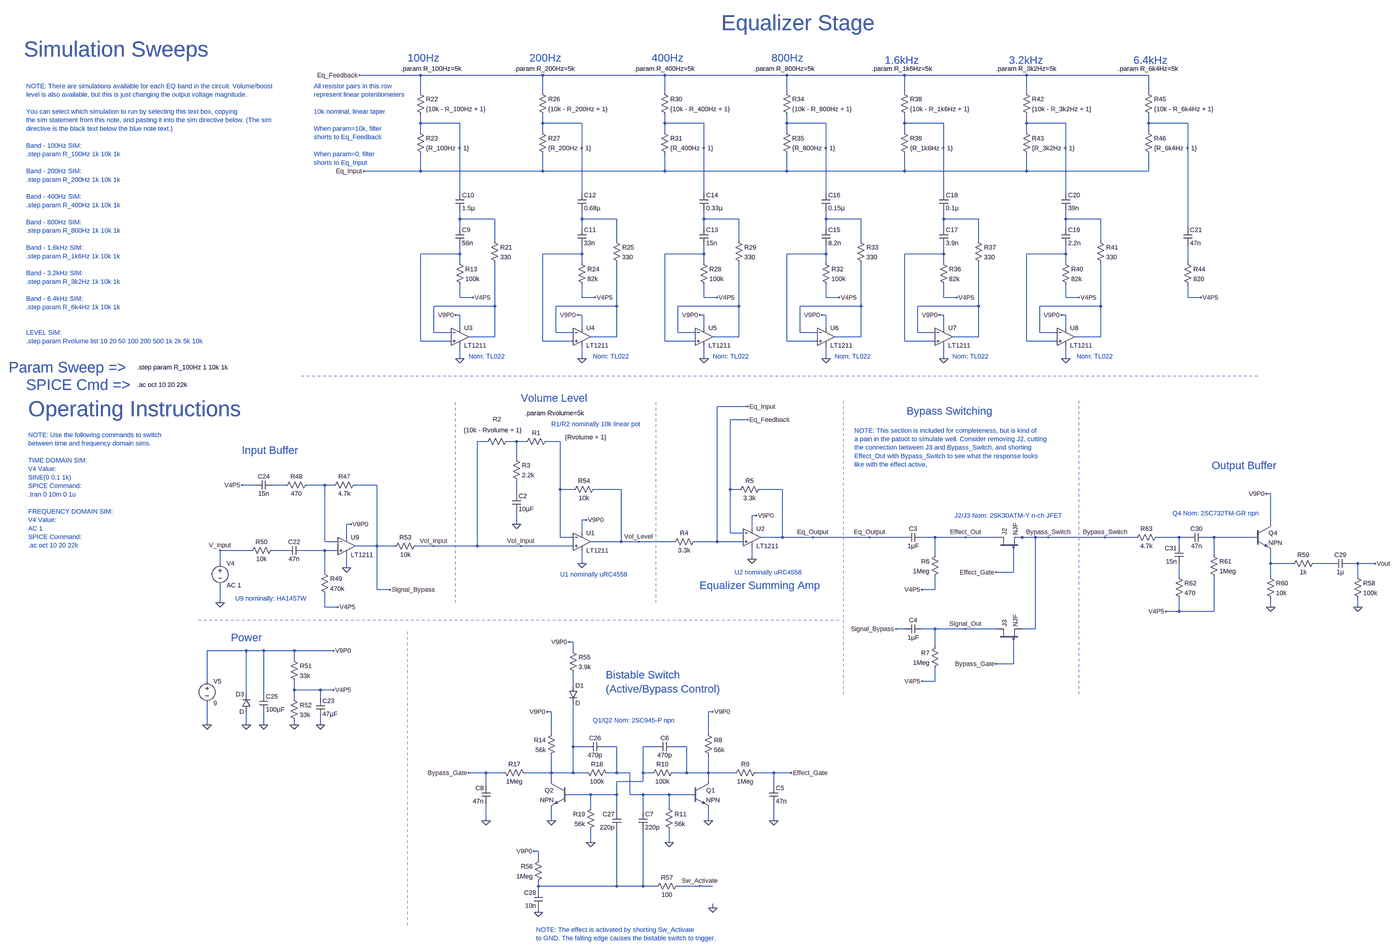
[diagram p0: schematic boss-ge7-equalizer.asc, whole sheet]
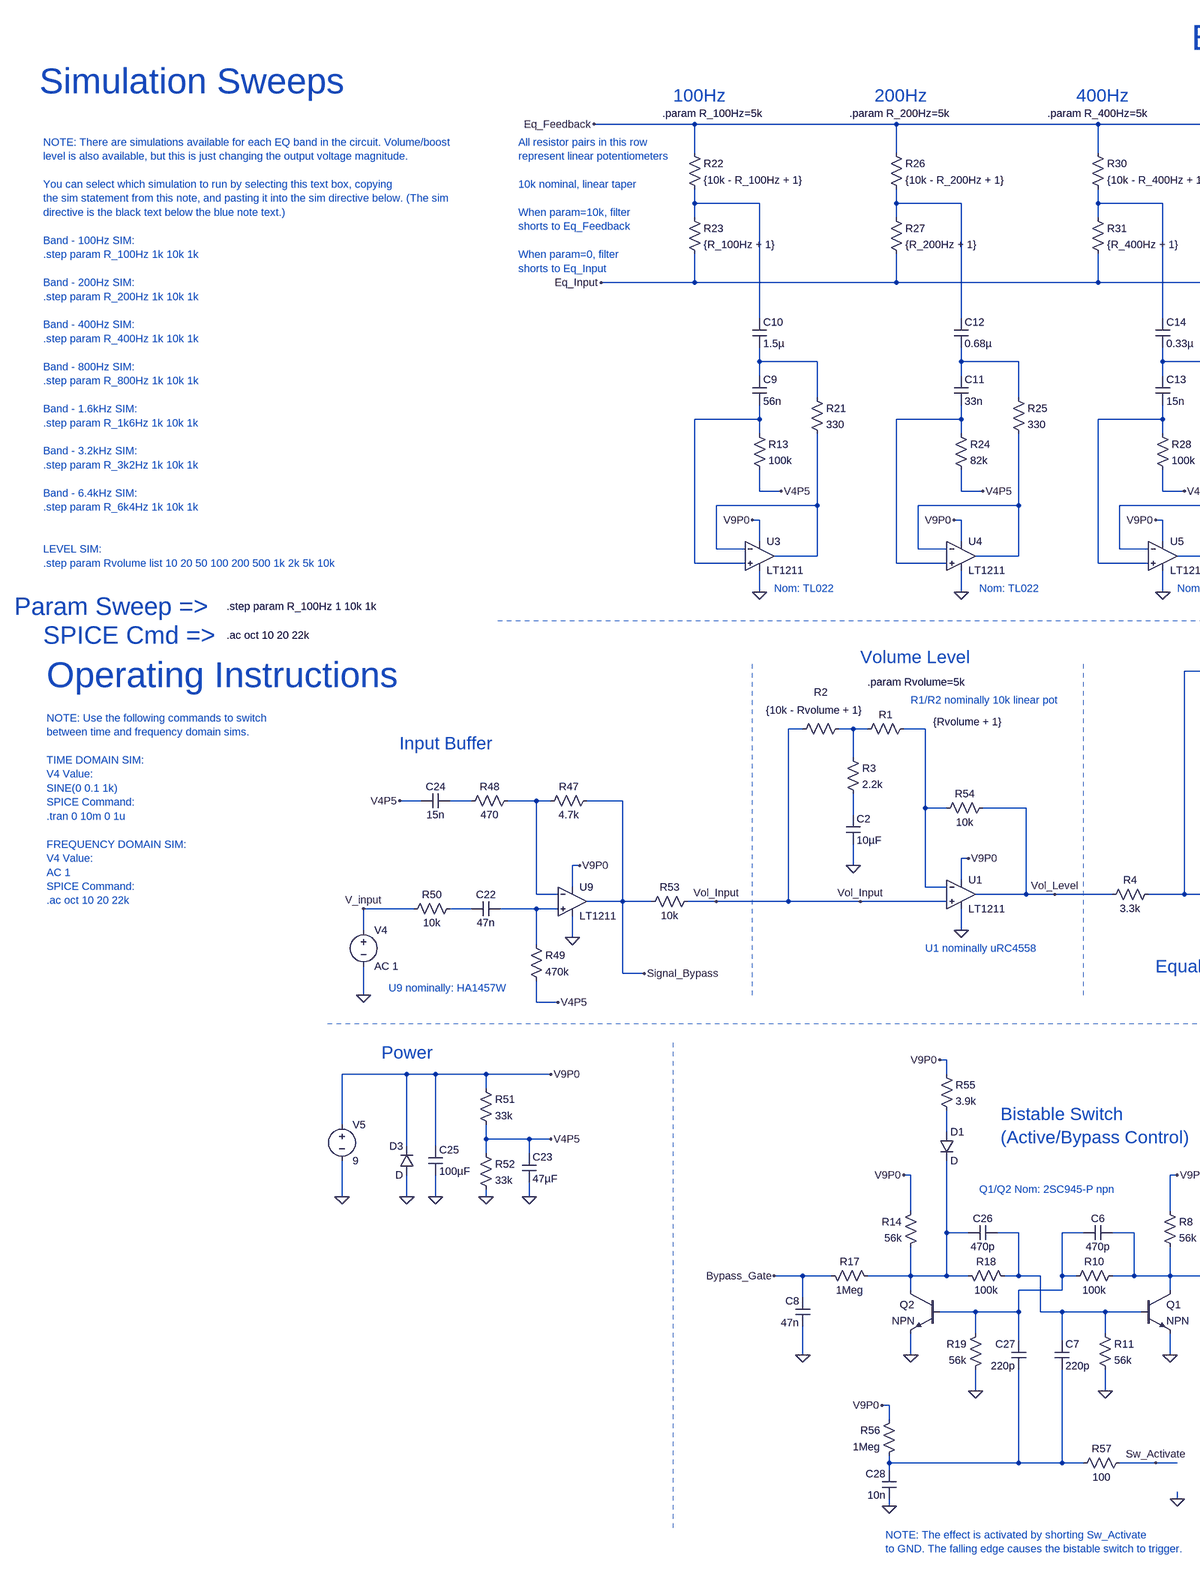
[diagram p1: schematic boss-ge7-equalizer.asc, part, row 1 of 1, column 1 of 2]
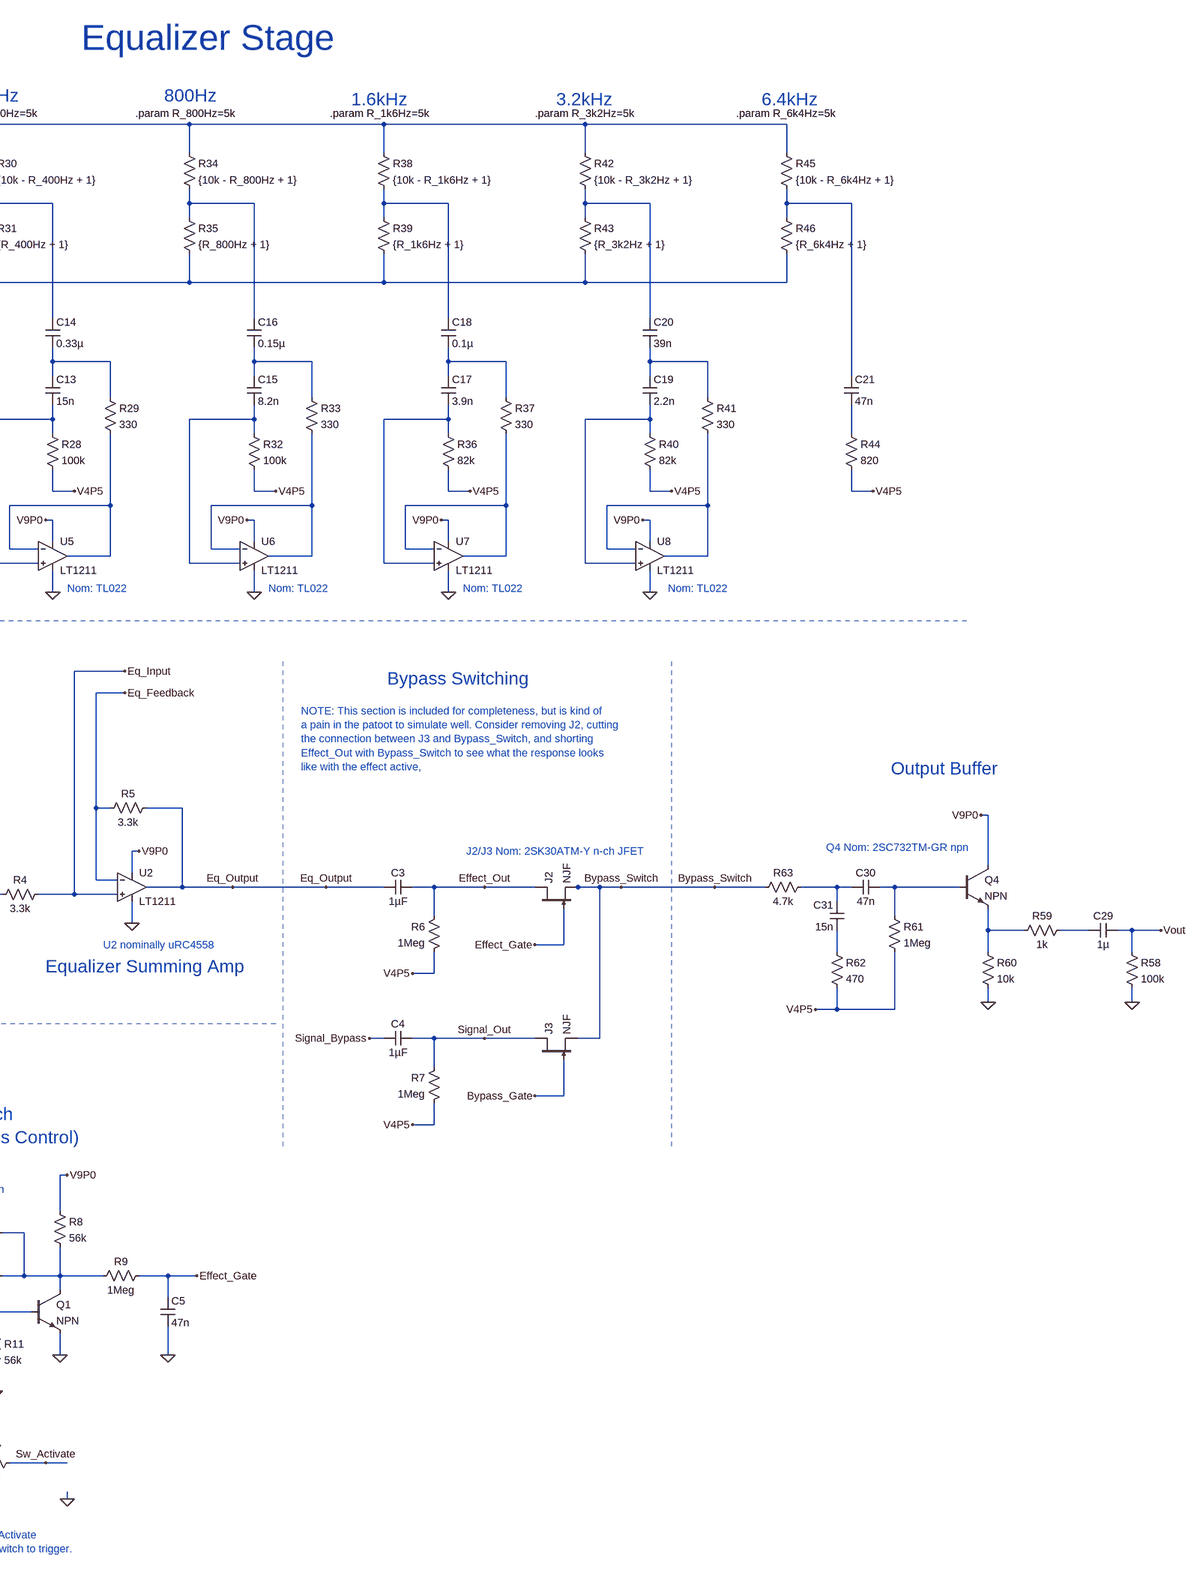
[diagram p2: schematic boss-ge7-equalizer.asc, part, row 1 of 1, column 2 of 2]
boss-ge7-equalizer.asc, the LTspice schematic file:
Version 4
SHEET 1 3852 5064
WIRE 160 1184 -64 1184
WIRE 608 1184 160 1184
WIRE 1056 1184 608 1184
WIRE 1504 1184 1056 1184
WIRE 1936 1184 1504 1184
WIRE 2384 1184 1936 1184
WIRE 2832 1184 2384 1184
WIRE 160 1248 160 1184
WIRE 608 1248 608 1184
WIRE 1056 1248 1056 1184
WIRE 1504 1248 1504 1184
WIRE 1936 1248 1936 1184
WIRE 2384 1248 2384 1184
WIRE 2832 1248 2832 1184
WIRE 160 1360 160 1328
WIRE 304 1360 160 1360
WIRE 608 1360 608 1328
WIRE 752 1360 608 1360
WIRE 1056 1360 1056 1328
WIRE 1200 1360 1056 1360
WIRE 1504 1360 1504 1328
WIRE 1648 1360 1504 1360
WIRE 1936 1360 1936 1328
WIRE 2080 1360 1936 1360
WIRE 2384 1360 2384 1328
WIRE 2528 1360 2384 1360
WIRE 2832 1360 2832 1328
WIRE 2976 1360 2832 1360
WIRE 160 1392 160 1360
WIRE 608 1392 608 1360
WIRE 1056 1392 1056 1360
WIRE 1504 1392 1504 1360
WIRE 1936 1392 1936 1360
WIRE 2384 1392 2384 1360
WIRE 2832 1392 2832 1360
WIRE 160 1536 160 1472
WIRE 160 1536 -48 1536
WIRE 608 1536 608 1472
WIRE 608 1536 160 1536
WIRE 1056 1536 1056 1472
WIRE 1056 1536 608 1536
WIRE 1504 1536 1504 1472
WIRE 1504 1536 1056 1536
WIRE 1936 1536 1936 1472
WIRE 1936 1536 1504 1536
WIRE 2384 1536 2384 1472
WIRE 2384 1536 1936 1536
WIRE 2832 1536 2832 1472
WIRE 2832 1536 2384 1536
WIRE 304 1616 304 1360
WIRE 752 1616 752 1360
WIRE 1200 1616 1200 1360
WIRE 1648 1616 1648 1360
WIRE 2080 1616 2080 1360
WIRE 2528 1616 2528 1360
WIRE 304 1712 304 1680
WIRE 432 1712 304 1712
WIRE 752 1712 752 1680
WIRE 880 1712 752 1712
WIRE 1200 1712 1200 1680
WIRE 1328 1712 1200 1712
WIRE 1648 1712 1648 1680
WIRE 1776 1712 1648 1712
WIRE 2080 1712 2080 1680
WIRE 2208 1712 2080 1712
WIRE 2528 1712 2528 1680
WIRE 2656 1712 2528 1712
WIRE 304 1744 304 1712
WIRE 752 1744 752 1712
WIRE 1200 1744 1200 1712
WIRE 1648 1744 1648 1712
WIRE 2080 1744 2080 1712
WIRE 2528 1744 2528 1712
WIRE 2976 1744 2976 1360
WIRE 432 1792 432 1712
WIRE 880 1792 880 1712
WIRE 1328 1792 1328 1712
WIRE 1776 1792 1776 1712
WIRE 2208 1792 2208 1712
WIRE 2656 1792 2656 1712
WIRE 304 1840 304 1808
WIRE 304 1840 160 1840
WIRE 752 1840 752 1808
WIRE 752 1840 608 1840
WIRE 1200 1840 1200 1808
WIRE 1200 1840 1056 1840
WIRE 1648 1840 1648 1808
WIRE 1648 1840 1504 1840
WIRE 2080 1840 2080 1808
WIRE 2080 1840 1936 1840
WIRE 2528 1840 2528 1808
WIRE 2528 1840 2384 1840
WIRE 304 1872 304 1840
WIRE 752 1872 752 1840
WIRE 1200 1872 1200 1840
WIRE 1648 1872 1648 1840
WIRE 2080 1872 2080 1840
WIRE 2528 1872 2528 1840
WIRE 2976 1872 2976 1808
WIRE 304 2000 304 1952
WIRE 352 2000 304 2000
WIRE 752 2000 752 1952
WIRE 800 2000 752 2000
WIRE 1200 2000 1200 1952
WIRE 1248 2000 1200 2000
WIRE 1648 2000 1648 1952
WIRE 1696 2000 1648 2000
WIRE 2080 2000 2080 1952
WIRE 2128 2000 2080 2000
WIRE 2528 2000 2528 1952
WIRE 2576 2000 2528 2000
WIRE 2976 2000 2976 1952
WIRE 3024 2000 2976 2000
WIRE 432 2032 432 1872
WIRE 432 2032 208 2032
WIRE 880 2032 880 1872
WIRE 880 2032 656 2032
WIRE 1328 2032 1328 1872
WIRE 1328 2032 1104 2032
WIRE 1776 2032 1776 1872
WIRE 1776 2032 1552 2032
WIRE 2208 2032 2208 1872
WIRE 2208 2032 1984 2032
WIRE 2656 2032 2656 1872
WIRE 2656 2032 2432 2032
WIRE 304 2064 288 2064
WIRE 752 2064 736 2064
WIRE 1200 2064 1184 2064
WIRE 1648 2064 1632 2064
WIRE 2080 2064 2064 2064
WIRE 2528 2064 2512 2064
WIRE 304 2112 304 2064
WIRE 752 2112 752 2064
WIRE 1200 2112 1200 2064
WIRE 1648 2112 1648 2064
WIRE 2080 2112 2080 2064
WIRE 2528 2112 2528 2064
WIRE 208 2128 208 2032
WIRE 272 2128 208 2128
WIRE 656 2128 656 2032
WIRE 720 2128 656 2128
WIRE 1104 2128 1104 2032
WIRE 1168 2128 1104 2128
WIRE 1552 2128 1552 2032
WIRE 1616 2128 1552 2128
WIRE 1984 2128 1984 2032
WIRE 2048 2128 1984 2128
WIRE 2432 2128 2432 2032
WIRE 2496 2128 2432 2128
WIRE 432 2144 432 2032
WIRE 432 2144 336 2144
WIRE 880 2144 880 2032
WIRE 880 2144 784 2144
WIRE 1328 2144 1328 2032
WIRE 1328 2144 1232 2144
WIRE 1776 2144 1776 2032
WIRE 1776 2144 1680 2144
WIRE 2208 2144 2208 2032
WIRE 2208 2144 2112 2144
WIRE 2656 2144 2656 2032
WIRE 2656 2144 2560 2144
WIRE 160 2160 160 1840
WIRE 272 2160 160 2160
WIRE 608 2160 608 1840
WIRE 720 2160 608 2160
WIRE 1056 2160 1056 1840
WIRE 1168 2160 1056 2160
WIRE 1504 2160 1504 1840
WIRE 1616 2160 1504 2160
WIRE 1936 2160 1936 1840
WIRE 2048 2160 1936 2160
WIRE 2384 2160 2384 1840
WIRE 2496 2160 2384 2160
WIRE 304 2224 304 2176
WIRE 752 2224 752 2176
WIRE 1200 2224 1200 2176
WIRE 1648 2224 1648 2176
WIRE 2080 2224 2080 2176
WIRE 2528 2224 2528 2176
WIRE 1360 2400 1248 2400
WIRE 1360 2448 1296 2448
WIRE 400 2528 368 2528
WIRE 512 2528 480 2528
WIRE 544 2528 512 2528
WIRE 672 2528 624 2528
WIRE 512 2592 512 2528
WIRE -448 2688 -496 2688
WIRE -336 2688 -384 2688
WIRE -192 2688 -256 2688
WIRE -160 2688 -192 2688
WIRE 0 2688 -80 2688
WIRE 672 2704 672 2528
WIRE 720 2704 672 2704
WIRE 896 2704 800 2704
WIRE 1296 2704 1296 2448
WIRE 1328 2704 1296 2704
WIRE 1488 2704 1408 2704
WIRE 512 2720 512 2672
WIRE 3280 2720 3264 2720
WIRE 1392 2800 1376 2800
WIRE 768 2816 752 2816
WIRE -96 2832 -112 2832
WIRE 512 2832 512 2784
WIRE 3280 2832 3280 2720
WIRE 1376 2848 1376 2800
WIRE 752 2864 752 2816
WIRE 1296 2864 1296 2704
WIRE 1344 2864 1296 2864
WIRE -112 2880 -112 2832
WIRE 672 2880 672 2704
WIRE 720 2880 672 2880
WIRE 1488 2880 1488 2704
WIRE 1488 2880 1408 2880
WIRE 1600 2880 1488 2880
WIRE 1808 2880 1600 2880
WIRE 1936 2880 1808 2880
WIRE 2048 2880 2000 2880
WIRE 2160 2880 2048 2880
WIRE 2272 2880 2160 2880
WIRE 2368 2880 2352 2880
WIRE 2416 2880 2368 2880
WIRE 2464 2880 2416 2880
WIRE 2672 2880 2464 2880
WIRE 2784 2880 2672 2880
WIRE 2944 2880 2864 2880
WIRE 2976 2880 2944 2880
WIRE 3072 2880 3040 2880
WIRE 3216 2880 3072 2880
WIRE -192 2896 -192 2688
WIRE -144 2896 -192 2896
WIRE 896 2896 896 2704
WIRE 896 2896 784 2896
WIRE 960 2896 896 2896
WIRE 1088 2896 960 2896
WIRE 1248 2896 1248 2400
WIRE 1248 2896 1168 2896
WIRE 1344 2896 1248 2896
WIRE 0 2912 0 2688
WIRE 0 2912 -80 2912
WIRE 64 2912 0 2912
WIRE 208 2912 144 2912
WIRE 368 2912 368 2528
WIRE 368 2912 208 2912
WIRE 528 2912 368 2912
WIRE 720 2912 528 2912
WIRE 2944 2912 2944 2880
WIRE -464 2928 -576 2928
WIRE -336 2928 -384 2928
WIRE -192 2928 -272 2928
WIRE -144 2928 -192 2928
WIRE 2048 2944 2048 2880
WIRE 3072 2944 3072 2880
WIRE 1376 2960 1376 2912
WIRE -576 2976 -576 2928
WIRE 752 2976 752 2928
WIRE 3280 2976 3280 2928
WIRE 3360 2976 3280 2976
WIRE 3504 2976 3440 2976
WIRE 3600 2976 3568 2976
WIRE 3664 2976 3600 2976
WIRE -112 2992 -112 2944
WIRE -192 3008 -192 2928
WIRE 2336 3008 2336 2928
WIRE 2336 3008 2272 3008
WIRE 2944 3024 2944 2976
WIRE 3280 3024 3280 2976
WIRE 3600 3024 3600 2976
WIRE 0 3072 0 2912
WIRE 48 3072 0 3072
WIRE 2048 3072 2048 3024
WIRE 2048 3072 2000 3072
WIRE -576 3120 -576 3056
WIRE -192 3136 -192 3088
WIRE -144 3136 -192 3136
WIRE 3280 3136 3280 3104
WIRE 3600 3136 3600 3104
WIRE 2944 3152 2944 3104
WIRE 2944 3152 2896 3152
WIRE 3072 3152 3072 3024
WIRE 3072 3152 2944 3152
WIRE 1936 3216 1904 3216
WIRE 2048 3216 2000 3216
WIRE 2160 3216 2048 3216
WIRE 2272 3216 2160 3216
WIRE 2416 3216 2416 2880
WIRE 2416 3216 2368 3216
WIRE 720 3264 704 3264
WIRE 2048 3280 2048 3216
WIRE -480 3296 -624 3296
WIRE -416 3296 -480 3296
WIRE -304 3296 -416 3296
WIRE -160 3296 -304 3296
WIRE 720 3296 720 3264
WIRE -304 3328 -304 3296
WIRE 2336 3344 2336 3264
WIRE 2336 3344 2272 3344
WIRE -624 3408 -624 3296
WIRE 2048 3408 2048 3360
WIRE 2048 3408 2000 3408
WIRE 720 3424 720 3376
WIRE -304 3440 -304 3408
WIRE -208 3440 -304 3440
WIRE -160 3440 -208 3440
WIRE -480 3456 -480 3296
WIRE -416 3456 -416 3296
WIRE -304 3472 -304 3440
WIRE -208 3472 -208 3440
WIRE 640 3520 624 3520
WIRE 1232 3520 1216 3520
WIRE -624 3568 -624 3488
WIRE -480 3568 -480 3520
WIRE -416 3568 -416 3520
WIRE -304 3568 -304 3552
WIRE -208 3568 -208 3536
WIRE 640 3600 640 3520
WIRE 1216 3600 1216 3520
WIRE 720 3648 720 3488
WIRE 768 3648 720 3648
WIRE 880 3648 832 3648
WIRE 1024 3648 976 3648
WIRE 1136 3648 1088 3648
WIRE 400 3744 336 3744
WIRE 464 3744 400 3744
WIRE 640 3744 640 3680
WIRE 640 3744 544 3744
WIRE 720 3744 720 3648
WIRE 720 3744 640 3744
WIRE 768 3744 720 3744
WIRE 880 3744 880 3648
WIRE 880 3744 848 3744
WIRE 928 3744 880 3744
WIRE 976 3744 976 3648
WIRE 1008 3744 976 3744
WIRE 1136 3744 1136 3648
WIRE 1136 3744 1088 3744
WIRE 1216 3744 1216 3680
WIRE 1216 3744 1136 3744
WIRE 1312 3744 1216 3744
WIRE 1456 3744 1392 3744
WIRE 1520 3744 1456 3744
WIRE 640 3776 640 3744
WIRE 976 3776 976 3744
WIRE 976 3776 880 3776
WIRE 1216 3776 1216 3744
WIRE 400 3792 400 3744
WIRE 1456 3792 1456 3744
WIRE 784 3824 704 3824
WIRE 880 3824 880 3776
WIRE 880 3824 784 3824
WIRE 928 3824 928 3744
WIRE 976 3824 928 3824
WIRE 1072 3824 976 3824
WIRE 1152 3824 1072 3824
WIRE 784 3872 784 3824
WIRE 1072 3872 1072 3824
WIRE 880 3888 880 3824
WIRE 976 3888 976 3824
WIRE 400 3920 400 3856
WIRE 640 3920 640 3872
WIRE 1216 3920 1216 3872
WIRE 1456 3920 1456 3856
WIRE 784 4000 784 3952
WIRE 1072 4000 1072 3952
WIRE 592 4032 576 4032
WIRE 592 4064 592 4032
WIRE 592 4160 592 4144
WIRE 880 4160 880 3952
WIRE 880 4160 592 4160
WIRE 976 4160 976 3952
WIRE 976 4160 880 4160
WIRE 1024 4160 976 4160
WIRE 1184 4160 1104 4160
WIRE 1232 4160 1184 4160
WIRE 592 4176 592 4160
WIRE 1232 4240 1232 4224
WIRE 592 4256 592 4240
FLAG 304 2224 0
FLAG 752 2224 0
FLAG 1200 2224 0
FLAG 1648 2224 0
FLAG 2080 2224 0
FLAG 2528 2224 0
FLAG -112 2992 0
FLAG -304 3568 0
FLAG -208 3568 0
FLAG -160 3296 V9P0
FLAG -96 2832 V9P0
FLAG -624 3568 0
FLAG -160 3440 V4P5
FLAG -144 3136 V4P5
FLAG -576 3120 0
FLAG -480 3568 0
FLAG -416 3568 0
FLAG 752 2976 0
FLAG 768 2816 V9P0
FLAG 512 2832 0
FLAG 1376 2960 0
FLAG 1392 2800 V9P0
FLAG 1360 2400 Eq_Input
FLAG 1360 2448 Eq_Feedback
FLAG -48 1536 Eq_Input
FLAG -64 1184 Eq_Feedback
FLAG 352 2000 V4P5
FLAG 800 2000 V4P5
FLAG 1248 2000 V4P5
FLAG 1696 2000 V4P5
FLAG 2128 2000 V4P5
FLAG 3024 2000 V4P5
FLAG 2576 2000 V4P5
FLAG 2000 3072 V4P5
FLAG 2000 3408 V4P5
FLAG -496 2688 V4P5
FLAG 1456 3920 0
FLAG 1232 3520 V9P0
FLAG 1072 4000 0
FLAG 1216 3920 0
FLAG 400 3920 0
FLAG 624 3520 V9P0
FLAG 784 4000 0
FLAG 640 3920 0
FLAG 704 3264 V9P0
FLAG 1520 3744 Effect_Gate
FLAG 336 3744 Bypass_Gate
FLAG 592 4256 0
FLAG 576 4032 V9P0
FLAG 3600 3136 0
FLAG 3280 3136 0
FLAG 3264 2720 V9P0
FLAG 2896 3152 V4P5
FLAG 2272 3008 Effect_Gate
FLAG 2272 3344 Bypass_Gate
FLAG 48 3072 Signal_Bypass
FLAG 1904 3216 Signal_Bypass
FLAG 288 2064 V9P0
FLAG 736 2064 V9P0
FLAG 1184 2064 V9P0
FLAG 1632 2064 V9P0
FLAG 2064 2064 V9P0
FLAG 2512 2064 V9P0
FLAG 2160 2880 Effect_Out
FLAG 2160 3216 Signal_Out
FLAG 1600 2880 Eq_Output
FLAG 1808 2880 Eq_Output
FLAG 3664 2976 Vout
FLAG 2464 2880 Bypass_Switch
FLAG 2672 2880 Bypass_Switch
FLAG 960 2896 Vol_Level
FLAG 528 2912 Vol_Input
FLAG 1232 4240 0
FLAG 1184 4160 Sw_Activate
FLAG 208 2912 Vol_Input
FLAG -576 2928 V_input
SYMBOL Opamps\\LT1211 304 2080 R0
SYMATTR InstName U3
SYMBOL res 288 1856 R0
SYMATTR InstName R13
SYMATTR Value 100k
SYMBOL res 416 1776 R0
SYMATTR InstName R21
SYMATTR Value 330
SYMBOL cap 288 1744 R0
SYMATTR InstName C9
SYMATTR Value 56n
SYMBOL cap 288 1616 R0
SYMATTR InstName C10
SYMATTR Value 1.5µ
SYMBOL res 144 1232 R0
SYMATTR InstName R22
SYMATTR Value {10k - R_100Hz + 1}
SYMBOL res 144 1376 R0
SYMATTR InstName R23
SYMATTR Value {R_100Hz + 1}
SYMBOL Opamps\\LT1211 752 2080 R0
SYMATTR InstName U4
SYMBOL res 736 1856 R0
SYMATTR InstName R24
SYMATTR Value 82k
SYMBOL res 864 1776 R0
SYMATTR InstName R25
SYMATTR Value 330
SYMBOL cap 736 1744 R0
SYMATTR InstName C11
SYMATTR Value 33n
SYMBOL cap 736 1616 R0
SYMATTR InstName C12
SYMATTR Value 0.68µ
SYMBOL res 592 1232 R0
SYMATTR InstName R26
SYMATTR Value {10k - R_200Hz + 1}
SYMBOL res 592 1376 R0
SYMATTR InstName R27
SYMATTR Value {R_200Hz + 1}
SYMBOL Opamps\\LT1211 1200 2080 R0
SYMATTR InstName U5
SYMBOL res 1184 1856 R0
SYMATTR InstName R28
SYMATTR Value 100k
SYMBOL res 1312 1776 R0
SYMATTR InstName R29
SYMATTR Value 330
SYMBOL cap 1184 1744 R0
SYMATTR InstName C13
SYMATTR Value 15n
SYMBOL cap 1184 1616 R0
SYMATTR InstName C14
SYMATTR Value 0.33µ
SYMBOL res 1040 1232 R0
SYMATTR InstName R30
SYMATTR Value {10k - R_400Hz + 1}
SYMBOL res 1040 1376 R0
SYMATTR InstName R31
SYMATTR Value {R_400Hz + 1}
SYMBOL Opamps\\LT1211 1648 2080 R0
SYMATTR InstName U6
SYMBOL res 1632 1856 R0
SYMATTR InstName R32
SYMATTR Value 100k
SYMBOL res 1760 1776 R0
SYMATTR InstName R33
SYMATTR Value 330
SYMBOL cap 1632 1744 R0
SYMATTR InstName C15
SYMATTR Value 8.2n
SYMBOL cap 1632 1616 R0
SYMATTR InstName C16
SYMATTR Value 0.15µ
SYMBOL res 1488 1232 R0
SYMATTR InstName R34
SYMATTR Value {10k - R_800Hz + 1}
SYMBOL res 1488 1376 R0
SYMATTR InstName R35
SYMATTR Value {R_800Hz + 1}
SYMBOL Opamps\\LT1211 2080 2080 R0
SYMATTR InstName U7
SYMBOL res 2064 1856 R0
SYMATTR InstName R36
SYMATTR Value 82k
SYMBOL res 2192 1776 R0
SYMATTR InstName R37
SYMATTR Value 330
SYMBOL cap 2064 1744 R0
SYMATTR InstName C17
SYMATTR Value 3.9n
SYMBOL cap 2064 1616 R0
SYMATTR InstName C18
SYMATTR Value 0.1µ
SYMBOL res 1920 1232 R0
SYMATTR InstName R38
SYMATTR Value {10k - R_1k6Hz + 1}
SYMBOL res 1920 1376 R0
SYMATTR InstName R39
SYMATTR Value {R_1k6Hz + 1}
SYMBOL Opamps\\LT1211 2528 2080 R0
SYMATTR InstName U8
SYMBOL res 2512 1856 R0
SYMATTR InstName R40
SYMATTR Value 82k
SYMBOL res 2640 1776 R0
SYMATTR InstName R41
SYMATTR Value 330
SYMBOL cap 2512 1744 R0
SYMATTR InstName C19
SYMATTR Value 2.2n
SYMBOL cap 2512 1616 R0
SYMATTR InstName C20
SYMATTR Value 39n
SYMBOL res 2368 1232 R0
SYMATTR InstName R42
SYMATTR Value {10k - R_3k2Hz + 1}
SYMBOL res 2368 1376 R0
SYMATTR InstName R43
SYMATTR Value {R_3k2Hz + 1}
SYMBOL res 2960 1856 R0
SYMATTR InstName R44
SYMATTR Value 820
SYMBOL cap 2960 1744 R0
SYMATTR InstName C21
SYMATTR Value 47n
SYMBOL res 2816 1232 R0
SYMATTR InstName R45
SYMATTR Value {10k - R_6k4Hz + 1}
SYMBOL res 2816 1376 R0
SYMATTR InstName R46
SYMATTR Value {R_6k4Hz + 1}
SYMBOL Opamps\\LT1211 -112 2848 R0
SYMATTR InstName U9
SYMBOL res -64 2672 R90
WINDOW 0 0 56 VBottom 2
WINDOW 3 32 56 VTop 2
SYMATTR InstName R47
SYMATTR Value 4.7k
SYMBOL res -240 2672 R90
WINDOW 0 0 56 VBottom 2
WINDOW 3 32 56 VTop 2
SYMATTR InstName R48
SYMATTR Value 470
SYMBOL cap -272 2912 R90
WINDOW 0 0 32 VBottom 2
WINDOW 3 32 32 VTop 2
SYMATTR InstName C22
SYMATTR Value 47n
SYMBOL res -208 2992 R0
SYMATTR InstName R49
SYMATTR Value 470k
SYMBOL res -368 2912 R90
WINDOW 0 0 56 VBottom 2
WINDOW 3 32 56 VTop 2
SYMATTR InstName R50
SYMATTR Value 10k
SYMBOL res -320 3312 R0
SYMATTR InstName R51
SYMATTR Value 33k
SYMBOL res -320 3456 R0
SYMATTR InstName R52
SYMATTR Value 33k
SYMBOL cap -224 3472 R0
SYMATTR InstName C23
SYMATTR Value 47µF
SYMBOL voltage -624 3392 R0
SYMATTR InstName V5
SYMATTR Value 9
SYMATTR SpiceLine Rser=0
SYMBOL cap -384 2672 R90
WINDOW 0 0 32 VBottom 2
WINDOW 3 32 32 VTop 2
SYMATTR InstName C24
SYMATTR Value 15n
SYMBOL voltage -576 2960 R0
SYMATTR InstName V4
SYMATTR Value AC 1
SYMATTR SpiceLine Rser=0
SYMBOL cap -432 3456 R0
SYMATTR InstName C25
SYMATTR Value 100µF
SYMBOL diode -464 3520 R180
WINDOW 0 24 64 Left 2
WINDOW 3 24 0 Left 2
SYMATTR InstName D3
SYMBOL res 160 2896 R90
WINDOW 0 0 56 VBottom 2
WINDOW 3 32 56 VTop 2
SYMATTR InstName R53
SYMATTR Value 10k
SYMBOL res 816 2688 R90
WINDOW 0 0 56 VBottom 2
WINDOW 3 32 56 VTop 2
SYMATTR InstName R54
SYMATTR Value 10k
SYMBOL Opamps\\LT1211 752 2832 R0
SYMATTR InstName U1
SYMBOL res 640 2512 R90
WINDOW 0 0 56 VBottom 2
WINDOW 3 -15 -126 VTop 2
SYMATTR InstName R1
SYMATTR Value {Rvolume + 1}
SYMBOL res 496 2512 R90
WINDOW 0 -50 56 VBottom 2
WINDOW 3 -41 71 VTop 2
SYMATTR InstName R2
SYMATTR Value {10k - Rvolume + 1}
SYMBOL res 496 2576 R0
SYMATTR InstName R3
SYMATTR Value 2.2k
SYMBOL cap 496 2720 R0
SYMATTR InstName C2
SYMATTR Value 10µF
SYMBOL res 1184 2880 R90
WINDOW 0 0 56 VBottom 2
WINDOW 3 32 56 VTop 2
SYMATTR InstName R4
SYMATTR Value 3.3k
SYMBOL Opamps\\LT1211 1376 2816 R0
SYMATTR InstName U2
SYMBOL res 1424 2688 R90
WINDOW 0 0 56 VBottom 2
WINDOW 3 32 56 VTop 2
SYMATTR InstName R5
SYMATTR Value 3.3k
SYMBOL cap 2000 2864 R90
WINDOW 0 0 32 VBottom 2
WINDOW 3 32 32 VTop 2
SYMATTR InstName C3
SYMATTR Value 1µF
SYMBOL res 2064 2928 M0
SYMATTR InstName R6
SYMATTR Value 1Meg
SYMBOL res 2064 3264 M0
SYMATTR InstName R7
SYMATTR Value 1Meg
SYMBOL cap 2000 3200 R90
WINDOW 0 0 32 VBottom 2
WINDOW 3 32 32 VTop 2
SYMATTR InstName C4
SYMATTR Value 1µF
SYMBOL npn 1152 3776 R0
SYMATTR InstName Q1
SYMBOL res 1200 3584 R0
SYMATTR InstName R8
SYMATTR Value 56k
SYMBOL res 1408 3728 R90
WINDOW 0 0 56 VBottom 2
WINDOW 3 32 56 VTop 2
SYMATTR InstName R9
SYMATTR Value 1Meg
SYMBOL cap 1440 3792 R0
SYMATTR InstName C5
SYMATTR Value 47n
SYMBOL res 1104 3728 R90
WINDOW 0 0 56 VBottom 2
WINDOW 3 32 56 VTop 2
SYMATTR InstName R10
SYMATTR Value 100k
SYMBOL cap 1088 3632 R90
WINDOW 0 0 32 VBottom 2
WINDOW 3 32 32 VTop 2
SYMATTR InstName C6
SYMATTR Value 470p
SYMBOL res 1056 3856 R0
SYMATTR InstName R11
SYMATTR Value 56k
SYMBOL cap 960 3888 R0
SYMATTR InstName C7
SYMATTR Value 220p
SYMBOL npn 704 3776 M0
SYMATTR InstName Q2
SYMBOL res 656 3584 M0
SYMATTR InstName R14
SYMATTR Value 56k
SYMBOL res 448 3728 M90
WINDOW 0 0 56 VBottom 2
WINDOW 3 32 56 VTop 2
SYMATTR InstName R17
SYMATTR Value 1Meg
SYMBOL cap 416 3792 M0
SYMATTR InstName C8
SYMATTR Value 47n
SYMBOL res 752 3728 M90
WINDOW 0 0 56 VBottom 2
WINDOW 3 32 56 VTop 2
SYMATTR InstName R18
SYMATTR Value 100k
SYMBOL cap 768 3632 M90
WINDOW 0 0 32 VBottom 2
WINDOW 3 32 32 VTop 2
SYMATTR InstName C26
SYMATTR Value 470p
SYMBOL res 800 3856 M0
SYMATTR InstName R19
SYMATTR Value 56k
SYMBOL cap 896 3888 M0
SYMATTR InstName C27
SYMATTR Value 220p
SYMBOL diode 704 3424 R0
SYMATTR InstName D1
SYMBOL res 704 3280 R0
SYMATTR InstName R55
SYMATTR Value 3.9k
SYMBOL res 608 4048 M0
SYMATTR InstName R56
SYMATTR Value 1Meg
SYMBOL cap 608 4176 M0
SYMATTR InstName C28
SYMATTR Value 10n
SYMBOL res 1120 4144 R90
WINDOW 0 0 56 VBottom 2
WINDOW 3 32 56 VTop 2
SYMATTR InstName R57
SYMATTR Value 100
SYMBOL res 3584 3008 R0
SYMATTR InstName R58
SYMATTR Value 100k
SYMBOL cap 3568 2960 R90
WINDOW 0 0 32 VBottom 2
WINDOW 3 32 32 VTop 2
SYMATTR InstName C29
SYMATTR Value 1µ
SYMBOL res 3456 2960 R90
WINDOW 0 0 56 VBottom 2
WINDOW 3 32 56 VTop 2
SYMATTR InstName R59
SYMATTR Value 1k
SYMBOL res 3264 3008 R0
SYMATTR InstName R60
SYMATTR Value 10k
SYMBOL npn 3216 2832 R0
SYMATTR InstName Q4
SYMBOL res 3056 2928 R0
SYMATTR InstName R61
SYMATTR Value 1Meg
SYMBOL cap 3040 2864 R90
WINDOW 0 0 32 VBottom 2
WINDOW 3 32 32 VTop 2
SYMATTR InstName C30
SYMATTR Value 47n
SYMBOL cap 2960 2976 R180
WINDOW 0 24 56 Left 2
WINDOW 3 24 8 Left 2
SYMATTR InstName C31
SYMATTR Value 15n
SYMBOL res 2928 3008 R0
SYMATTR InstName R62
SYMATTR Value 470
SYMBOL res 2880 2864 R90
WINDOW 0 0 56 VBottom 2
WINDOW 3 32 56 VTop 2
SYMATTR InstName R63
SYMATTR Value 4.7k
SYMBOL njf 2272 2928 R270
SYMATTR InstName J2
SYMBOL njf 2272 3264 R270
SYMATTR InstName J3
TEXT -1288 1224 Left 2 ;NOTE: There are simulations available for each EQ band in the circuit. Volume/boost \nlevel is also available, but this is just changing the output voltage magnitude.\n \nYou can select which simulation to run by selecting this text box, copying \nthe sim statement from this note, and pasting it into the sim directive below. (The sim \ndirective is the black text below the blue note text.)\n \nBand - 100Hz SIM:\n.step param R_100Hz 1k 10k 1k\n \nBand - 200Hz SIM:\n.step param R_200Hz 1k 10k 1k\n \nBand - 400Hz SIM:\n.step param R_400Hz 1k 10k 1k\n \nBand - 800Hz SIM:\n.step param R_800Hz 1k 10k 1k\n \nBand - 1.6kHz SIM:\n.step param R_1k6Hz 1k 10k 1k\n \nBand - 3.2kHz SIM:\n.step param R_3k2Hz 1k 10k 1k\n \nBand - 6.4kHz SIM:\n.step param R_6k4Hz 1k 10k 1k\n \n \nLEVEL SIM:\n.step param Rvolume list 10 20 50 100 200 500 1k 2k 5k 10k
TEXT 112 1120 Left 4 ;100Hz
TEXT 560 1120 Left 4 ;200Hz
TEXT 1008 1120 Left 4 ;400Hz
TEXT 1448 1120 Left 4 ;800Hz
TEXT 1864 1128 Left 4 ;1.6kHz
TEXT 2320 1128 Left 4 ;3.2kHz
TEXT 2776 1128 Left 4 ;6.4kHz
TEXT -496 2560 Left 4 ;Input Buffer
TEXT -536 3248 Left 4 ;Power
TEXT 528 2368 Left 4 ;Volume Level
TEXT 1264 992 Left 6 ;Equalizer Stage
TEXT 840 3384 Left 4 ;Bistable Switch \n(Active/Bypass Control)
TEXT 3064 2616 Left 4 ;Output Buffer
TEXT 88 1160 Left 2 !.param R_100Hz=5k
TEXT 504 1160 Left 2 !.param R_200Hz=5k
TEXT 944 1160 Left 2 !.param R_400Hz=5k
TEXT 1384 1160 Left 2 !.param R_800Hz=5k
TEXT 1816 1160 Left 2 !.param R_1k6Hz=5k
TEXT 2272 1160 Left 2 !.param R_3k2Hz=5k
TEXT 2720 1160 Left 2 !.param R_6k4Hz=5k
TEXT 544 2424 Left 2 !.param Rvolume=5k
TEXT 336 2216 Left 2 ;Nom: TL022
TEXT 792 2216 Left 2 ;Nom: TL022
TEXT 1232 2216 Left 2 ;Nom: TL022
TEXT 1680 2216 Left 2 ;Nom: TL022
TEXT 2112 2216 Left 2 ;Nom: TL022
TEXT 2568 2216 Left 2 ;Nom: TL022
TEXT 1944 2416 Left 4 ;Bypass Switching
TEXT 1752 2488 Left 2 ;NOTE: This section is included for completeness, but is kind of \na pain in the patoot to simulate well. Consider removing J2, cutting \nthe connection between J3 and Bypass_Switch, and shorting \nEffect_Out with Bypass_Switch to see what the response looks \nlike with the effect active,
TEXT 1312 3008 Left 2 ;U2 nominally uRC4558
TEXT 672 3016 Left 2 ;U1 nominally uRC4558
TEXT 1184 3056 Left 4 ;Equalizer Summing Amp
TEXT 2120 2800 Left 2 ;J2/J3 Nom: 2SK30ATM-Y n-ch JFET
TEXT 2920 2792 Left 2 ;Q4 Nom: 2SC732TM-GR npn
TEXT -1280 2504 Left 2 ;NOTE: Use the following commands to switch \nbetween time and frequency domain sims.\n \nTIME DOMAIN SIM:\nV4 Value: \nSINE(0 0.1 1k)\nSPICE Command: \n.tran 0 10m 0 1u\n \nFREQUENCY DOMAIN SIM:\nV4 Value: \nAC 1\nSPICE Command:\n.ac oct 10 20 22k
TEXT -880 2256 Left 2 !.step param R_100Hz 1 10k 1k
TEXT -880 2320 Left 2 !.ac oct 10 20 22k
TEXT -1288 2320 Left 5 ;SPICE Cmd =>
TEXT -1352 2256 Left 5 ;Param Sweep =>
TEXT 584 4320 Left 2 ;NOTE: The effect is activated by shorting Sw_Activate \nto GND. The falling edge causes the bistable switch to trigger.
TEXT 792 3552 Left 2 ;Q1/Q2 Nom: 2SC945-P npn
TEXT -520 3104 Left 2 ;U9 nominally: HA1457W
TEXT -1296 1088 Left 6 ;Simulation Sweeps
TEXT -1280 2408 Left 6 ;Operating Instructions
TEXT 640 2464 Left 2 ;R1/R2 nominally 10k linear pot
TEXT -232 1224 Left 2 ;All resistor pairs in this row \nrepresent linear potentiometers\n \n10k nominal, linear taper\n \nWhen param=10k, filter \nshorts to Eq_Feedback\n \nWhen param=0, filter \nshorts to Eq_Input
LINE Normal 3232 2288 -288 2288 2
LINE Normal 2576 3456 2576 2368 2
LINE Normal 1712 3456 1712 2368 2
LINE Normal 1024 3120 1024 2384 2
LINE Normal 288 3120 288 2384 2
LINE Normal 1696 3184 -656 3184 2
LINE Normal 112 4304 112 3216 2

The netlist it stands for:
* boss-ge7-equalizer.asc
XU3 N014 N021 V9P0 0 N021 LT1211  ; pins In+ In- V+ V- OUT
R13 N014 V4P5 100k
R21 N008 N021 330
C9 N008 N014 56n
C10 N001 N008 1.5µ
R22 Eq_Feedback N001 {10k - R_100Hz + 1}
R23 N001 Eq_Input {R_100Hz + 1}
XU4 N015 N022 V9P0 0 N022 LT1211  ; pins In+ In- V+ V- OUT
R24 N015 V4P5 82k
R25 N009 N022 330
C11 N009 N015 33n
C12 N002 N009 0.68µ
R26 Eq_Feedback N002 {10k - R_200Hz + 1}
R27 N002 Eq_Input {R_200Hz + 1}
XU5 N016 N023 V9P0 0 N023 LT1211  ; pins In+ In- V+ V- OUT
R28 N016 V4P5 100k
R29 N010 N023 330
C13 N010 N016 15n
C14 N003 N010 0.33µ
R30 Eq_Feedback N003 {10k - R_400Hz + 1}
R31 N003 Eq_Input {R_400Hz + 1}
XU6 N017 N024 V9P0 0 N024 LT1211  ; pins In+ In- V+ V- OUT
R32 N017 V4P5 100k
R33 N011 N024 330
C15 N011 N017 8.2n
C16 N004 N011 0.15µ
R34 Eq_Feedback N004 {10k - R_800Hz + 1}
R35 N004 Eq_Input {R_800Hz + 1}
XU7 N018 N025 V9P0 0 N025 LT1211  ; pins In+ In- V+ V- OUT
R36 N018 V4P5 82k
R37 N012 N025 330
C17 N012 N018 3.9n
C18 N005 N012 0.1µ
R38 Eq_Feedback N005 {10k - R_1k6Hz + 1}
R39 N005 Eq_Input {R_1k6Hz + 1}
XU8 N019 N026 V9P0 0 N026 LT1211  ; pins In+ In- V+ V- OUT
R40 N019 V4P5 82k
R41 N013 N026 330
C19 N013 N019 2.2n
C20 N006 N013 39n
R42 Eq_Feedback N006 {10k - R_3k2Hz + 1}
R43 N006 Eq_Input {R_3k2Hz + 1}
R44 N020 V4P5 820
C21 N007 N020 47n
R45 Eq_Feedback N007 {10k - R_6k4Hz + 1}
R46 N007 Eq_Input {R_6k4Hz + 1}
XU9 N035 N030 V9P0 0 Signal_Bypass LT1211  ; pins In+ In- V+ V- OUT
R47 Signal_Bypass N030 4.7k
R48 N030 N029 470
C22 N035 N034 47n
R49 N035 V4P5 470k
R50 N034 V_input 10k
R51 V9P0 V4P5 33k
R52 V4P5 0 33k
C23 V4P5 0 47µF
V5 V9P0 0 9 Rser=0
C24 N029 V4P5 15n
V4 V_input 0 AC 1 Rser=0
C25 V9P0 0 100µF
D3 0 V9P0 D
R53 Vol_Input Signal_Bypass 10k
R54 Vol_Level N028 10k
XU1 Vol_Input N028 V9P0 0 Vol_Level LT1211  ; pins In+ In- V+ V- OUT
R1 N028 N027 {Rvolume + 1}
R2 N027 Vol_Input {10k - Rvolume + 1}
R3 N027 N031 2.2k
C2 N031 0 10µF
R4 Eq_Input Vol_Level 3.3k
XU2 Eq_Input Eq_Feedback V9P0 0 Eq_Output LT1211  ; pins In+ In- V+ V- OUT
R5 Eq_Output Eq_Feedback 3.3k
C3 Effect_Out Eq_Output 1µF
R6 Effect_Out V4P5 1Meg
R7 Signal_Out V4P5 1Meg
C4 Signal_Out Signal_Bypass 1µF
Q1 N043 N041 0 0 NPN
R8 V9P0 N043 56k
R9 Effect_Gate N043 1Meg
C5 Effect_Gate 0 47n
R10 N043 N042 100k
C6 N043 N042 470p
R11 N041 0 56k
C7 N041 N044 220p
Q2 N040 N042 0 0 NPN
R14 V9P0 N040 56k
R17 Bypass_Gate N040 1Meg
C8 Bypass_Gate 0 47n
R18 N040 N041 100k
C26 N040 N041 470p
R19 N042 0 56k
C27 N042 N044 220p
D1 N039 N040 D
R55 V9P0 N039 3.9k
R56 V9P0 N044 1Meg
C28 N044 0 10n
R57 Sw_Activate N044 100
R58 Vout 0 100k
C29 Vout N037 1µ
R59 N037 N036 1k
R60 N036 0 10k
Q4 V9P0 N033 N036 0 NPN
R61 N033 V4P5 1Meg
C30 N033 N032 47n
C31 N038 N032 15n
R62 N038 V4P5 470
R63 N032 Bypass_Switch 4.7k
J2 Effect_Out Effect_Gate Bypass_Switch NJF
J3 Signal_Out Bypass_Gate Bypass_Switch NJF
.model D D
.lib standard.dio
.model NPN NPN
.model PNP PNP
.lib standard.bjt
.model NJF NJF
.model PJF PJF
.lib standard.jft
* NOTE: There are simulations available for each EQ band in the circuit. Volume/boost
* level is also available, but this is just changing the output voltage magnitude.
* You can select which simulation to run by selecting this text box, copying
* the sim statement from this note, and pasting it into the sim directive below. (The sim
* directive is the black text below the blue note text.)
* Band - 100Hz SIM:
* .step param R_100Hz 1k 10k 1k
* Band - 200Hz SIM:
* .step param R_200Hz 1k 10k 1k
* Band - 400Hz SIM:
* .step param R_400Hz 1k 10k 1k
* Band - 800Hz SIM:
* .step param R_800Hz 1k 10k 1k
* Band - 1.6kHz SIM:
* .step param R_1k6Hz 1k 10k 1k
* Band - 3.2kHz SIM:
* .step param R_3k2Hz 1k 10k 1k
* Band - 6.4kHz SIM:
* .step param R_6k4Hz 1k 10k 1k
* LEVEL SIM:
* .step param Rvolume list 10 20 50 100 200 500 1k 2k 5k 10k
* 100Hz
* 200Hz
* 400Hz
* 800Hz
* 1.6kHz
* 3.2kHz
* 6.4kHz
* Input Buffer
* Power
* Volume Level
* Equalizer Stage
* Bistable Switch
* (Active/Bypass Control)
* Output Buffer
.param R_100Hz=5k
.param R_200Hz=5k
.param R_400Hz=5k
.param R_800Hz=5k
.param R_1k6Hz=5k
.param R_3k2Hz=5k
.param R_6k4Hz=5k
.param Rvolume=5k
* Nom: TL022
* Nom: TL022
* Nom: TL022
* Nom: TL022
* Nom: TL022
* Nom: TL022
* Bypass Switching
* NOTE: This section is included for completeness, but is kind of
* a pain in the patoot to simulate well. Consider removing J2, cutting
* the connection between J3 and Bypass_Switch, and shorting
* Effect_Out with Bypass_Switch to see what the response looks
* like with the effect active,
* U2 nominally uRC4558
* U1 nominally uRC4558
* Equalizer Summing Amp
* J2/J3 Nom: 2SK30ATM-Y n-ch JFET
* Q4 Nom: 2SC732TM-GR npn
* NOTE: Use the following commands to switch
* between time and frequency domain sims.
* TIME DOMAIN SIM:
* V4 Value:
* SINE(0 0.1 1k)
* SPICE Command:
* .tran 0 10m 0 1u
* FREQUENCY DOMAIN SIM:
* V4 Value:
* AC 1
* SPICE Command:
* .ac oct 10 20 22k
.step param R_100Hz 1 10k 1k
.ac oct 10 20 22k
* SPICE Cmd =>
* Param Sweep =>
* NOTE: The effect is activated by shorting Sw_Activate
* to GND. The falling edge causes the bistable switch to trigger.
* Q1/Q2 Nom: 2SC945-P npn
* U9 nominally: HA1457W
* Simulation Sweeps
* Operating Instructions
* R1/R2 nominally 10k linear pot
* All resistor pairs in this row
* represent linear potentiometers
* 10k nominal, linear taper
* When param=10k, filter
* shorts to Eq_Feedback
* When param=0, filter
* shorts to Eq_Input
.lib LTC.lib
.backanno
.end